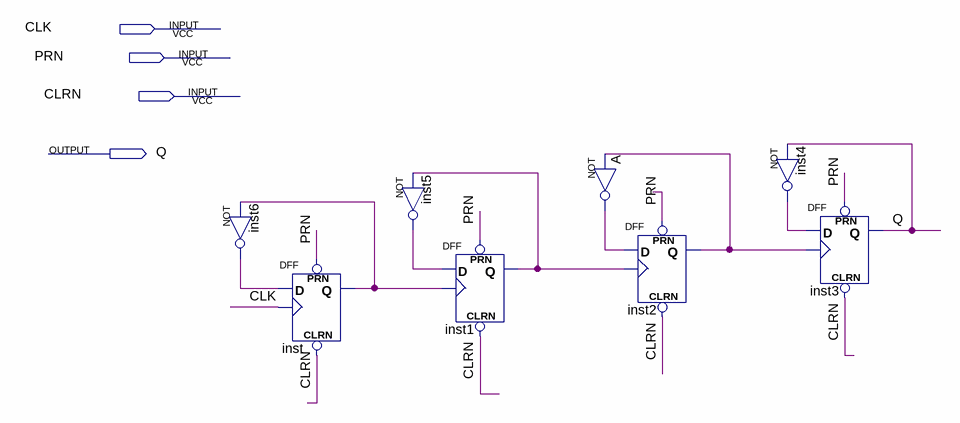
[diagram p0: schematic sheet]
// Quartus schematic FFFF.bdf as structural Verilog: 8 symbols, 4 pins
module FFFF (
  input  CLK,
  input  PRN,
  input  CLRN,
  output Q
);

  wire A_out, inst1_q, inst2_q, inst4_out, inst5_out, inst6_out, inst_q;

  not inst6 (inst6_out, inst_q);
  DFF inst (.CLRN(CLRN), .CLK(CLK), .D(inst6_out), .PRN(PRN), .Q(inst_q));
  not inst5 (inst5_out, inst1_q);
  DFF inst1 (.CLRN(CLRN), .CLK(inst_q), .D(inst5_out), .PRN(PRN), .Q(inst1_q));
  not A (A_out, inst2_q);
  DFF inst2 (.CLRN(CLRN), .CLK(inst1_q), .D(A_out), .PRN(PRN), .Q(inst2_q));
  not inst4 (inst4_out, Q);
  DFF inst3 (.CLRN(CLRN), .CLK(inst2_q), .D(inst4_out), .PRN(PRN), .Q(Q));
endmodule
